# EasyEDA Pro project ProPrj_Inverted_MAML_6x6_2026-07-06(1).epro, schematic FT2232_a
Create Date: 2025-11-25; Page Name: P1; Project Name: FPGA_motors_V3_0; Schematic Name: FT2232_a; Update Date: 2025-11-25; Company: EasyEDA.com; Page Size: A4; Version: V1.0
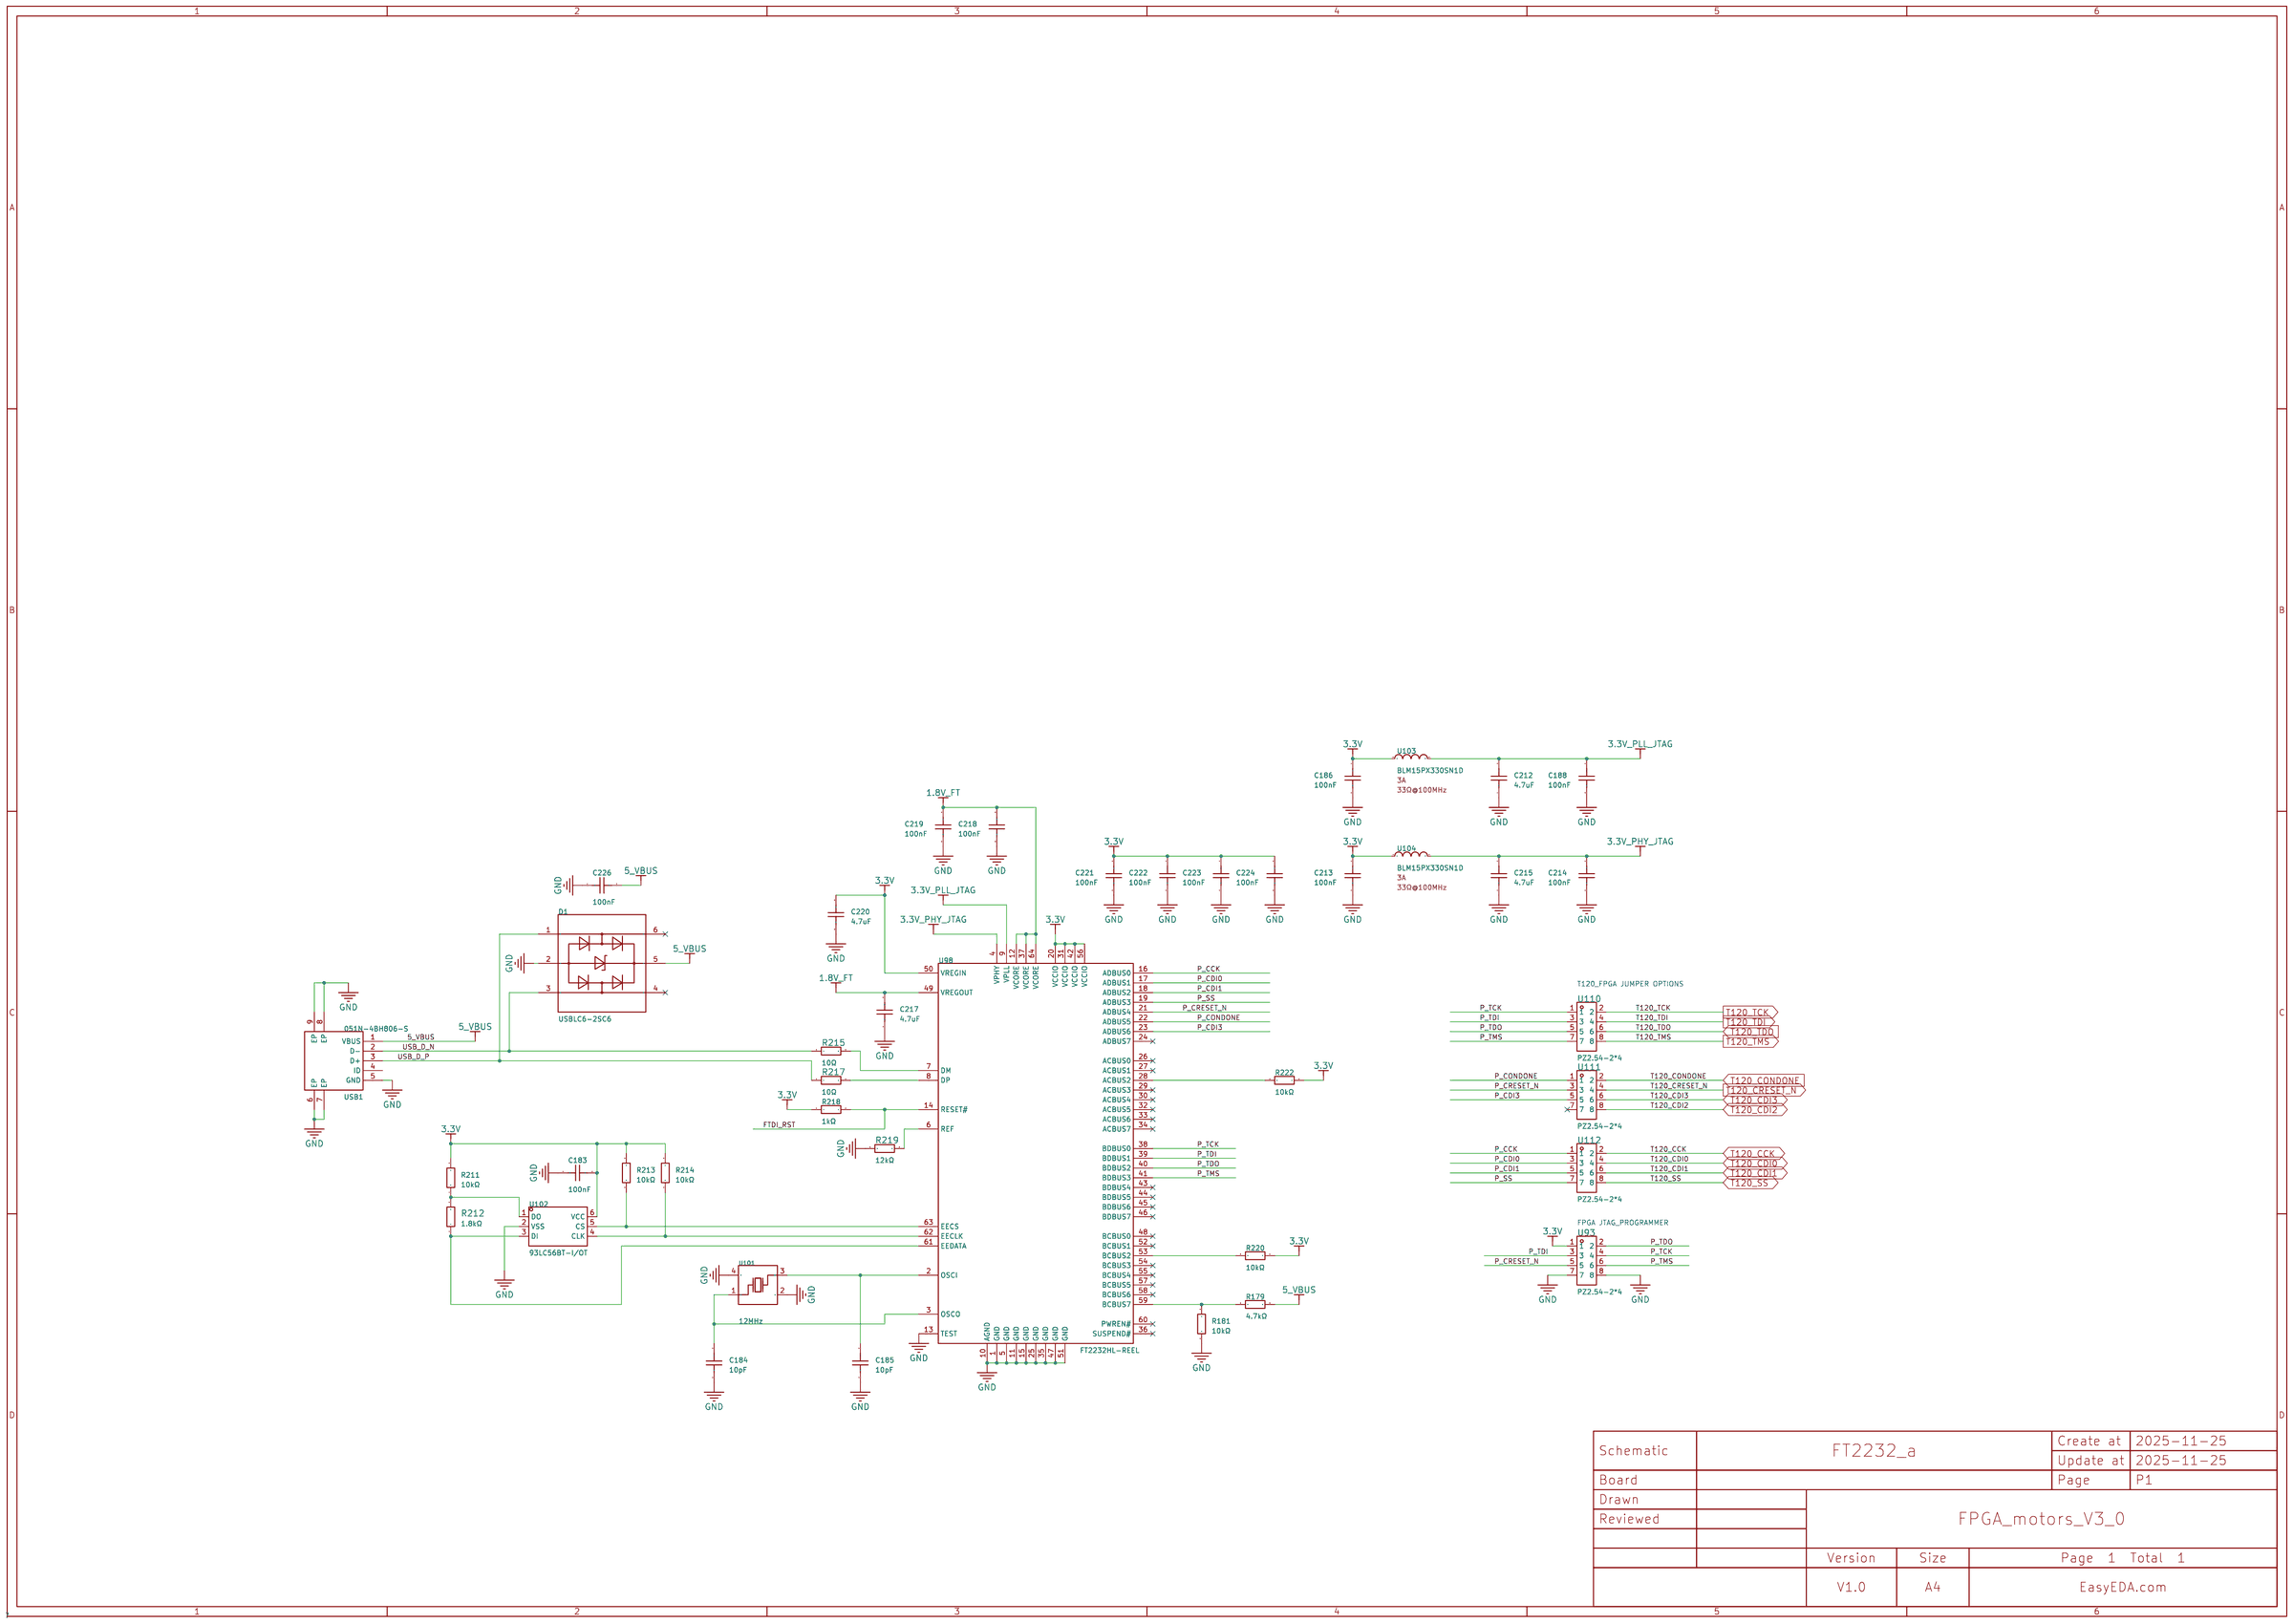
[diagram p3: schematic sheet]

## Parts
C183  100nF  [C0402]  (no BOM)
C184  10pF  [C0402]
C185  10pF  [C0402]
C186  100nF  [C0402]
C188  100nF  [C0402]
C212  4.7uF  [C0402]
C213  100nF  [C0402]
C214  100nF  [C0402]
C215  4.7uF  [C0402]
C217  4.7uF  [C0402]
C218  100nF  [C0402]
C219  100nF  [C0402]
C220  4.7uF  [C0402]
C221  100nF  [C0402]
C222  100nF  [C0402]
C223  100nF  [C0402]
C224  100nF  [C0402]
C226  100nF  [C0402]  (no BOM)
D1  USBLC6-2SC6  [SOT-23-6_L2.9-W1.6-P0.95-LS2.8-BL]
R179  4.7kΩ  [R0402]
R181  10kΩ  [R0402]
R211  10kΩ  [R0402]
R212  1.8kΩ  [R0402]
R213  10kΩ  [R0402]
R214  10kΩ  [R0402]
R215  10Ω  [R0402]
R217  10Ω  [R0402]
R218  1kΩ  [R0402]
R219  12kΩ  [R0402]
R220  10kΩ  [R0402]
R222  10kΩ  [R0402]
U93  PZ2.54-2*4  [HDR-TH_8P-P2.54-V-M-R2-C4-S2.54]
U98  FT2232HL-REEL  [LQFP-64_L10.0-W10.0-P0.50-LS12.0-TL]
U101  12MHz  [CRYSTAL-SMD_4P-L3.2-W2.5-BL]
U102  93LC56BT-I/OT  [SOT-23-6_L2.9-W1.6-P0.95-LS2.8-BR]  (no BOM)
U103  BLM15PX330SN1D  [L0402]
U104  BLM15PX330SN1D  [L0402]
U110  PZ2.54-2*4  [HDR-TH_8P-P2.54-V-M-R2-C4-S2.54]
U111  PZ2.54-2*4  [HDR-TH_8P-P2.54-V-M-R2-C4-S2.54]
U112  PZ2.54-2*4  [HDR-TH_8P-P2.54-V-M-R2-C4-S2.54]
USB1  051N-4BH806-S  [MICRO-USB-SMD_051N-4BH806-S]

## Library data of the parts
C183 C186 C188 C213 C214 C218 C219 C221-C224 C226 = CL05B104KB54PNC: Capacitance: Tolerance:±10% Tolerance:±10% Voltage Rated: Temperature Coefficient:; LCSC Part Name: 100nF ±10% 50V; Supplier Part: C307331; Manufacturer: SAMSUNG(三星); Supplier Footprint: 0402; JLCPCB Part Class: Basic Part; Datasheet: https://atta.szlcsc.com/upload/public/pdf/source/20160218/1457707763339.pdf; Supplier: LCSC; Tolerance: ±10%; Check: true
C184 C185 = CL05C100JB5NNNC: Capacitance:10pF Tolerance:±5% Tolerance:±5% Voltage Rating:50V Temperature Coefficient:C0G; LCSC Part Name: 10pF ±5% 50V; Supplier Part: C32949; Manufacturer: SAMSUNG(三星); Supplier Footprint: 0402; JLCPCB Part Class: Basic Part; Datasheet: https://item.szlcsc.com/datasheet/CL05C100JB5NNNC/33914.html; Supplier: LCSC; Tolerance: ±5%; Voltage Rating: 50V; Temperature Coefficient: C0G
C212 C215 C217 C220 = CL05A475MP5NRNC: Capacitance:4.7uF Tolerance:±20% Tolerance:±20% Voltage Rating:10V Temperature Coefficient:X5R; LCSC Part Name: 4.7uF ±20% 10V; Supplier Part: C23733; Manufacturer: SAMSUNG(三星); Supplier Footprint: 0402; JLCPCB Part Class: Basic Part; Datasheet: https://item.szlcsc.com/datasheet/CL05A475MP5NRNC/24469.html; Supplier: LCSC; Tolerance: ±20%; Temperature Coefficient: X5R; Voltage Rating: 10V
D1 = USBLC6-2SC6_C7519: Polarity:Unidirectional Reverse Stand-Off Voltage (Vrwm):5.25V Clamping Voltage:17V Peak Pulse Current (Ipp):5A Voltage - Breakdown:6V Reverse Leakage Current (Ir):150nA Number of Channels:2 Operating Temperature:-40℃~+125℃ Operating Temperature:-40℃~+125; LCSC Part Name: 单向ESD; Supplier Part: C7519; Manufacturer: ST(意法半导体); Supplier Footprint: SOT-23-6L; JLCPCB Part Class: Extended Part; Datasheet: https://item.szlcsc.com/datasheet/USBLC6-2SC6/7996.html; Supplier: LCSC; Polarity: Unidirectional; Reverse Stand-Off Voltage (Vrwm): 5.25V; Clamping Voltage: 17V; Peak Pulse Current (Ipp): 5A; Voltage - Breakdown: 6V; Reverse Leakage Current (Ir): 150nA; Number of Channels: 2; Operating Temperature: -40℃~+125℃; level of protection: IEC 61000-4-2; Type: ESD; Junction Capacitance: 3.5pF
R179 = 0402WGF4701TCE: Type:Thick Film Resistors Resistance:4.7kΩ Tolerance:±1% Tolerance:±1% Power(Watts): Overload Voltage (Max): Temperature Coefficient:±100ppm/℃ Temperature Coefficient:±100ppm/℃ Operating Temperature Range:-55℃~+155℃ Operating Temperature Range:-55℃~+155℃; LCSC Part Name: 4.7kΩ ±1% 62.5mW 厚膜电阻; Supplier Part: C25900; Manufacturer: UNI-ROYAL(厚声); Supplier Footprint: 0402; JLCPCB Part Class: Basic Part; Datasheet: https://item.szlcsc.com/datasheet/0402WGF4701TCE/26643.html; Supplier: LCSC; Type: Thick Film Resistor; Tolerance: ±1%; Power(Watts): 62.5mW; Voltage-Supply(Max): 50V; Temperature Coefficient: ±100ppm/℃; Operating Temperature: -55℃~+155℃
R181 R211 R213 R214 R220 R222 = 0402WGF1002TCE: Type:Thick Film Resistors Resistance:10kΩ Tolerance:±1% Tolerance:±1% Power(Watts): Overload Voltage (Max): Temperature Coefficient:±100ppm/℃ Temperature Coefficient:±100ppm/℃ Operating Temperature Range:-55℃~+155℃ Operating Temperature Range:-55℃~+155℃; LCSC Part Name: 10kΩ ±1% 62.5mW 厚膜电阻; Supplier Part: C25744; Manufacturer: UNI-ROYAL(厚声); Supplier Footprint: 0402; JLCPCB Part Class: Basic Part; Datasheet: https://atta.szlcsc.com/upload/public/pdf/source/20200306/C422600_1E6D84923E4A46A82E41ADD87F860B5C.pdf; Supplier: LCSC; Type: Thick Film Resistors; Tolerance: ±1%; Temperature Coefficient: ±100ppm/℃; Operating Temperature Range: -55℃~+155℃
R212 = 0402WGF1801TCE: Type:Thick Film Resistor Resistance:1.8kΩ Tolerance:±1% Tolerance:±1% Power(Watts):62.5mW Voltage-Supply(Max):50V Temperature Coefficient:±100ppm/℃ Temperature Coefficient:±100ppm/℃ Operating Temperature:-55℃~+155℃ Operating Temperature:-55℃~+155℃; LCSC Part Name: 1.8kΩ ±1% 62.5mW 厚膜电阻; Supplier Part: C25871; Manufacturer: UNI-ROYAL(厚声); Supplier Footprint: 0402; JLCPCB Part Class: Extended Part; Datasheet: https://item.szlcsc.com/datasheet/0402WGF1801TCE/26614.html; Supplier: LCSC; Type: Thick Film Resistor; Tolerance: ±1%; Power(Watts): 62.5mW; Voltage-Supply(Max): 50V; Temperature Coefficient: ±100ppm/℃; Operating Temperature: -55℃~+155℃
R215 R217 = 0402WGF100JTCE: Type:Thick Film Resistor Resistance:10Ω Tolerance:±1% Tolerance:±1% Power(Watts):62.5mW Voltage-Supply(Max):50V Temperature Coefficient:±200ppm/℃ Temperature Coefficient:±200ppm/℃ Operating Temperature:-55℃~+155℃ Operating Temperature:-55℃~+155℃; LCSC Part Name: 10Ω ±1% 62.5mW 厚膜电阻; Supplier Part: C25077; Manufacturer: UNI-ROYAL(厚声); Supplier Footprint: 0402; JLCPCB Part Class: Basic Part; Datasheet: https://item.szlcsc.com/datasheet/0402WGF100JTCE/25820.html; Supplier: LCSC; Type: Thick Film Resistor; Tolerance: ±1%; Power(Watts): 62.5mW; Voltage-Supply(Max): 50V; Temperature Coefficient: ±200ppm/℃; Operating Temperature: -55℃~+155℃
R218 = 0402WGF1001TCE: Type:Thick Film Resistor Resistance:1kΩ Tolerance:±1% Tolerance:±1% Power(Watts):62.5mW Voltage-Supply(Max):50V Temperature Coefficient:±100ppm/℃ Temperature Coefficient:±100ppm/℃ Operating Temperature:-55℃~+155℃ Operating Temperature:-55℃~+155℃; LCSC Part Name: 1kΩ ±1% 62.5mW 厚膜电阻; Supplier Part: C11702; Manufacturer: UNI-ROYAL(厚声); Supplier Footprint: 0402; JLCPCB Part Class: Basic Part; Datasheet: https://item.szlcsc.com/datasheet/0402WGF1001TCE/12256.html; Supplier: LCSC; Type: Thick Film Resistor; Tolerance: ±1%; Power(Watts): 62.5mW; Voltage-Supply(Max): 50V; Temperature Coefficient: ±100ppm/℃; Operating Temperature: -55℃~+155℃
R219 = 0402WGJ0123TCE: Type:Thick Film Resistor Resistance:12kΩ Tolerance:±5% Tolerance:±5% Power(Watts):62.5mW Voltage-Supply(Max):50V Temperature Coefficient:±100ppm/℃ Temperature Coefficient:±100ppm/℃ Operating Temperature:-55℃~+155℃ Operating Temperature:-55℃~+155℃; LCSC Part Name: 12kΩ ±5% 62.5mW 厚膜电阻; Supplier Part: C25535; Manufacturer: UNI-ROYAL(厚声); Supplier Footprint: 0402; JLCPCB Part Class: Extended Part; Datasheet: https://item.szlcsc.com/datasheet/0402WGJ0123TCE/26278.html; Supplier: LCSC; Type: Thick Film Resistor; Tolerance: ±5%; Power(Watts): 62.5mW; Voltage-Supply(Max): 50V; Temperature Coefficient: ±100ppm/℃; Operating Temperature: -55℃~+155℃
U93 U110-U112 = PZ2.54-2*4: Pin Structure:2x4P Pitch:2.54mm Number of Rows:双排 Number of Pins:8P; Supplier Part: C5156676; Manufacturer: ZHOURI(洲日); Supplier Footprint: 插件,P=2.54mm; JLCPCB Part Class: Extended Part; Datasheet: https://atta.szlcsc.com/upload/public/pdf/source/20220923/0E7A4A94740FFD503E2D73F36F92C1EA.pdf; Supplier: LCSC; Pin Structure: 2x4P; Pitch: 2.54mm; Number of Rows: 双排; Number of Pins: 8P; Check: true
U98 = FT2232HL-REEL: Applications Function:USB to UART；USB to FIFO Protocol:- Voltage - Supply:- Voltage - Supply:- Operating Temperature:-40℃~+85℃ Operating Temperature:-40℃~+85℃; LCSC Part Name: FT2232H迷你模块USB高速评估模块; Supplier Part: C27882; Manufacturer: FTDI(飞特帝亚); Supplier Footprint: LQFP-64(10x10); JLCPCB Part Class: Extended Part; Datasheet: https://item.szlcsc.com/datasheet/FT2232HL-REEL/28632.html; Supplier: LCSC; Applications Function: USB to UART；USB to FIFO; Operating Temperature: -40℃~+85℃
U101 = ECS-120-10-33B-CKM-TR: Frequency:12MHz Normal temperature Frequency Tolerance:±10ppm Normal temperature Frequency Tolerance:±10ppm External load capacitor: Frequency Stability(Full temperature range):±10ppm Frequency Stability(Full temperature range):±10ppm Equivalent Series Re; LCSC Part Name: 12MHz ±10ppm 10pF; Supplier Part: C2450718; Manufacturer: ECS; Supplier Footprint: SMD3225-4P; JLCPCB Part Class: Extended Part; Datasheet: https://atta.szlcsc.com/upload/public/pdf/source/20221101/385B7103C37C13CA6DFA158A3381826D.pdf; Supplier: LCSC; Normal temperature Frequency Tolerance: ±10ppm; Frequency Stability(Full temperature range): ±10ppm; Equivalent Series Resistance (ESR): 100Ω
U102 = 93LC56BT-I/OT: Interface Type:SPI Memory Size:2Kbit Supply Voltage:2.5V~5.5V Supply Voltage:2.5V~5.5V Write Cycle Time (Tw):6ms Data Retention - TDR (Year):200 years Write Cycle Endurance:1,000,000 Times Operating Temperature:-40℃~+85℃ Operating Temperature:-40℃~+85℃; Supplier Part: C190271; Manufacturer: MICROCHIP(美国微芯); Supplier Footprint: SOT-23-6; JLCPCB Part Class: Extended Part; Datasheet: https://atta.szlcsc.com/upload/public/pdf/source/20140724/1457707164359.pdf; Supplier: LCSC; Interface Type: SPI; Memory Size: 2Kbit; Supply Voltage: 2.5V~5.5V; Write Cycle Time (Tw): 6ms; Data Retention - TDR (Year): 200 years; Write Cycle Endurance: 1,000,000 Times; Operating Temperature: -40℃~+85℃
U103 U104 = BLM15PX330SN1D: Impedance @ Frequency:33Ω@100MHz Tolerance:±25% Tolerance:±25% DC Resistance(DCR):22mΩ Current Rating:3A Number of Circuits:1; LCSC Part Name: 单路 0402磁珠 阻抗33Ω@100MHz; Supplier Part: C160974; Manufacturer: muRata(村田); Supplier Footprint: 0402; JLCPCB Part Class: Extended Part; Datasheet: https://item.szlcsc.com/datasheet/BLM15PX330SN1D/172355.html; Supplier: LCSC; Impedance @ Frequency: 33Ω@100MHz; Tolerance: ±25%; DC Resistance(DCR): 22mΩ; Current Rating: 3A; Number of Circuits: 1
USB1 = 051N-4BH806-S: Supplier Part: C25503148; Manufacturer: HanElectricity(瀚源); Supplier Footprint: SMD; JLCPCB Part Class: Extended Part; Datasheet: https://atta.szlcsc.com/upload/public/pdf/source/20240704/B9ACE647D7515FFB86E3BAE398E1EB22.pdf; Supplier: LCSC; Check: true

## Nets
1.8V_FT: C217.2 C218.1 C219.1 U98.12(VCORE) U98.37(VCORE) U98.49(VREGOUT) U98.64(VCORE)
3.3V: C183.2 C186.1 C213.1 C220.2 C221.1 C222.1 C223.1 C224.1 R211.2 R213.2 R214.2 R218.1 R220.1 R222.1 U93.1 U98.20(VCCIO) U98.31(VCCIO) U98.42(VCCIO) U98.50(VREGIN) U98.56(VCCIO) U102.6(VCC) U103.1 U104.1
3.3V_PHY_JTAG: C214.1 C215.2 U98.4(VPHY) U104.2
3.3V_PLL_JTAG: C188.1 C212.2 U98.9(VPLL) U103.2
GND: C183.1 C184.1 C185.1 C186.2 C188.2 C212.1 C213.2 C214.2 C215.1 C217.1 C218.2 C219.2 C220.1 C221.2 C222.2 C223.2 C224.2 C226.1 D1.2 R181.1 R219.1 U93.7 U93.8 U98.1(GND) U98.5(GND) U98.10(AGND) U98.11(GND) U98.13(TEST) U98.15(GND) U98.25(GND) U98.35(GND) U98.47(GND) U98.51(GND) U101.2(Gnd) U101.4(Gnd) U102.2(VSS) USB1.5(GND) USB1.6(EP) USB1.7(EP) USB1.8(EP) USB1.9(EP)
5_VBUS: C226.2 D1.5 R179.2 USB1.1(VBUS)
FTDI_RST: R218.2 U98.14(RESET#)
P_CCK: U98.16(ADBUS0) U112.1
P_CDI0: U98.17(ADBUS1) U112.3
P_CDI1: U98.18(ADBUS2) U112.5
P_CDI3: U98.23(ADBUS6) U111.5
P_CONDONE: U98.22(ADBUS5) U111.1
P_CRESET_N: U93.5 U98.21(ADBUS4) U111.3
P_SS: U98.19(ADBUS3) U112.7
P_TCK: U93.4 U98.38(BDBUS0) U110.1
P_TDI: U93.3 U98.39(BDBUS1) U110.3
P_TDO: U93.2 U98.40(BDBUS2) U110.5
P_TMS: U93.6 U98.41(BDBUS3) U110.7
T120_CCK: U112.2
T120_CDI0: U112.4
T120_CDI1: U112.6
T120_CDI2: U111.8
T120_CDI3: U111.6
T120_CONDONE: U111.2
T120_CRESET_N: U111.4
T120_SS: U112.8
T120_TCK: U110.2
T120_TDI: U110.4
T120_TDO: U110.6
T120_TMS: U110.8
USB_D_N: D1.3 R215.1 USB1.2(D-)
USB_D_P: D1.1 R217.1 USB1.3(D+)
Net-(C184-2): C184.2 U98.3(OSCO) U101.1(In/Out)
Net-(C185-2): C185.2 U98.2(OSCI) U101.3(Out/In)
Net-(R179-1): R179.1 R181.2 U98.59(BCBUS7)
Net-(R211-1): R211.1 R212.2 U102.1(DO)
Net-(R212-1): R212.1 U98.61(EEDATA) U102.3(DI)
Net-(R213-1): R213.1 U98.63(EECS) U102.5(CS)
Net-(R214-1): R214.1 U98.62(EECLK) U102.4(CLK)
Net-(R215-2): R215.2 U98.7(DM)
Net-(R217-2): R217.2 U98.8(DP)
Net-(R219-2): R219.2 U98.6(REF)
Net-(R220-2): R220.2 U98.53(BCBUS2)
Net-(R222-2): R222.2 U98.28(ACBUS2)

Not connected (* = marked no-connect by the designer): D1 4* 6*; U98 24(ADBUS7)* 26(ACBUS0)* 27(ACBUS1)* 29(ACBUS3)* 30(ACBUS4)* 32(ACBUS5)* 33(ACBUS6)* 34(ACBUS7)* 36(SUSPEND#)* 43(BDBUS4)* 44(BDBUS5)* 45(BDBUS6)* 46(BDBUS7)* 48(BCBUS0)* 52(BCBUS1)* 54(BCBUS3)* 55(BCBUS4)* 57(BCBUS5)* 58(BCBUS6)* 60(PWREN#)*; U111 7*; USB1 4(ID)

## Notes on the sheet
- T120_FPGA JUMPER OPTIONS
- FPGA JTAG_PROGRAMMER
